# Altium schematic sheet ExtModules.SchDoc
size A4
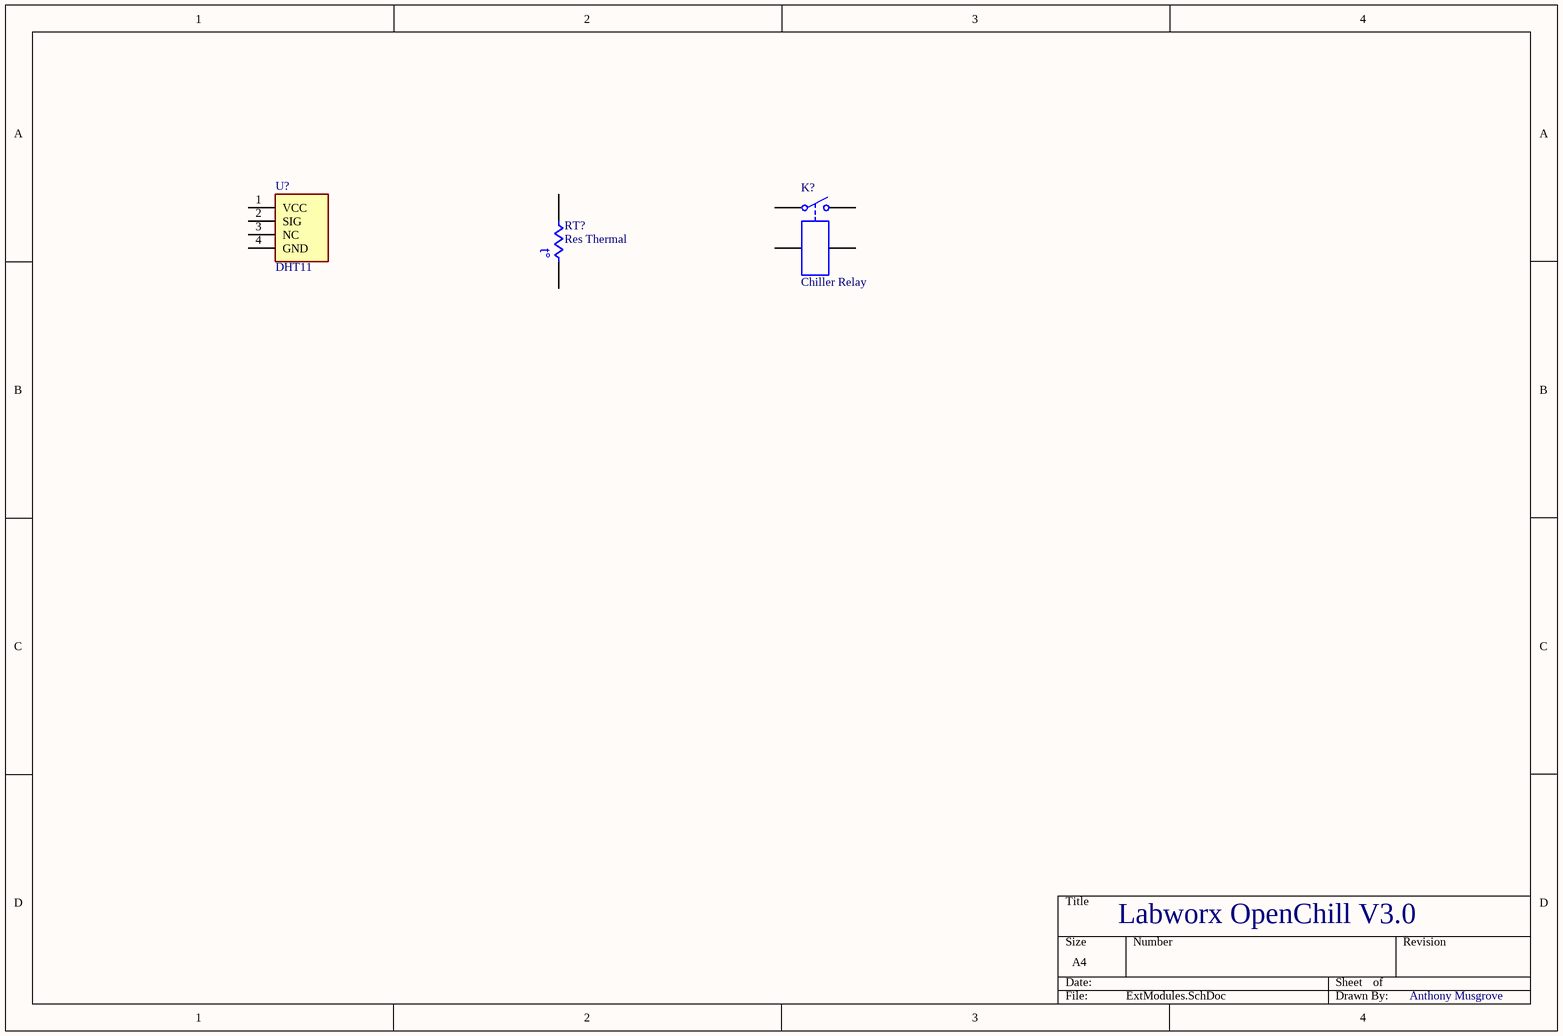
[diagram p0: ExtModules.SchDoc]

## Parts
K?  Chiller Relay  [MODULE4]
RT?  Res Thermal  [6-0805_N]
U?  DHT11  [DHT11]

## Nets

Not connected (* = marked no-connect by the designer): K? 1 2 3 4; RT? 1 2; U? 1(VCC) 2(SIG) 3(NC) 4(GND)

## Notes on the sheet
- Labworx OpenChill V3.0
- Anthony Musgrove
- (in symbol Res Thermal) t°

## Library data of the parts
K? = Relay-SPST: Single-Pole Single-Throw Relay; Published: 24-Mar-1999; LatestRevisionDate: 17-Jul-2002; LatestRevisionNote: Re-released for DXP Platform.; PackageReference: MODULE4; Publisher: Altium Limited
RT? = Res Thermal: Thermistor; Published: 24-Mar-1999; LatestRevisionDate: 29-May-2009; LatestRevisionNote: IPC-7351 Footprint Added.; PackageVersion: Mar-2003; PackageReference: 6-0805; Publisher: Altium Limited; PackageDescription: Chip Resistor 0805 Case Size; Code_IPC: RESC2012
U? = DHT11: SENSOR HUMIDITY/TEMPERATURE; Digikey PN: 1528-1228-ND